# Altium schematic sheet 12V_Buck.SchDoc: Title
size A3; Project: Q24 VCU; ENG_APP_DATE: --/--/--; DSN_APP_DATE: --/--/--; CHK_APP_DATE: --/--/--; Date: *******; ApprovedBy: *******; CheckedBy: None; Author: *******; CompanyName: *******; DrawnBy: Jacob Chisholm; Engineer: *******; Organization: *******; Address1: *******; Address2: *******; Address3: *******; Address4: *******; DocumentNumber: 10; Revision: *******; SheetNumber: 10; SheetTotal: 14; Address_Website: https://jchisholm204.github.io; E-Mail: JacobChisholm1010@gmail.com; CurrentTime: *******; CurrentDate: *******; Time: *******; DocumentFullPathAndName: *******; DocumentName: *******; ModifiedDate: *******; ImagePath: *******; ProjectName: *******; Application_BuildNumber: *******
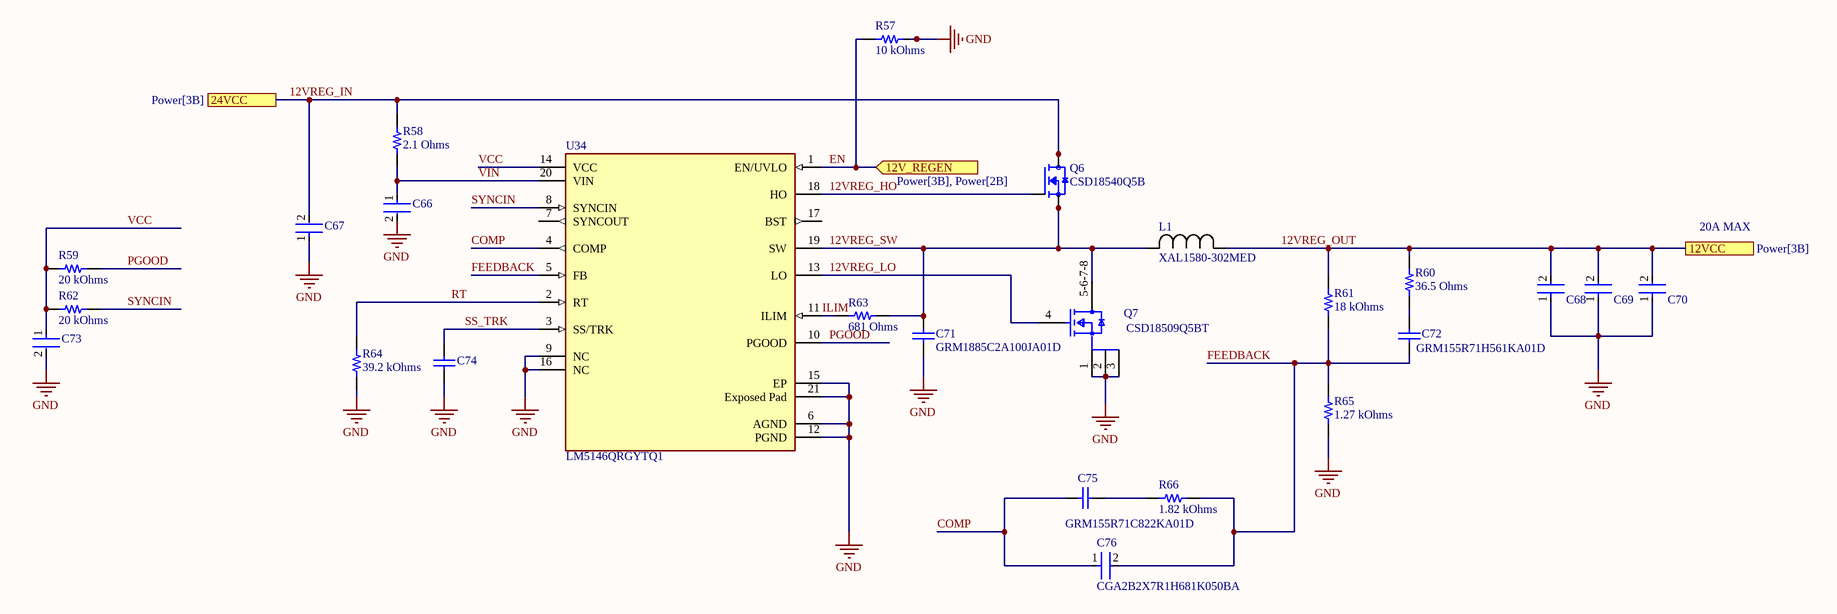
[diagram p0: 12V_Buck.SchDoc]

## Parts
C66  CGA3E2X7R1H104K080AA  [FP-CGA3E-0_3-0_1-IPC_A]  (value not drawn)
C67  GRM32ER71H475KA88L  [FP-GRM32-MFG]  (value not drawn)
C68  GRM32ER61E226KE15L  [FP-GRM32-MFG]  (value not drawn)
C69  GRM32ER61E226KE15L  [FP-GRM32-MFG]  (value not drawn)
C70  GRM32ER61E226KE15L  [FP-GRM32-MFG]  (value not drawn)
C71  GRM1885C2A100JA01D  [CAPC1608X90X35LL10T15]
C72  GRM155R71H561KA01D  [CAPC1005X55X25LL05T10]
C73  C1005X5R1V225K050BC  [FP-C1005-050-0_15-IPC_A]  (value not drawn)
C74  GRM155R71C563KA88D  [CAPC1005X55X25ML05T10]  (value not drawn)
C75  GRM155R71C822KA01D  [CAPC1005X55X25NL05T10]
C76  CGA2B2X7R1H681K050BA  [FP-CGA2B-IPC_C]
L1  XAL1580-302MED  [IND_XAL1580-302MED_COC]
Q6  CSD18540Q5B  [TRANS_CSD18540Q5B]
Q7  CSD18509Q5BT  [FP-DNK0008A-MFG]
R57  10 kOhms  [RES 0603_1608]
R58  2.1 Ohms  [RES 0603_1608]
R59  20 kOhms  [RES 0603_1608]
R60  36.5 Ohms  [RES 0603_1608]
R61  18 kOhms  [RES 0603_1608]
R62  20 kOhms  [RES 0603_1608]
R63  681 Ohms  [RES 0402_1005]
R64  39.2 kOhms  [RES 0603_1608]
R65  1.27 kOhms  [RES 0603_1608]
R66  1.82 kOhms  [RES 0603_1608]
U34  LM5146QRGYTQ1  [FP-RGY0020B-MFG]

## Ports
12V_REGEN (in, see Power[3B], Power[2B]), 12VCC (see Power[3B]), 24VCC (see Power[3B])

## Nets
GND: C66.2 C67.1 C68.1 C69.1 C70.1 C71.1 C73.2 C74.1 Q7.1(S) Q7.2(S) Q7.3(S) R57.2 R64.1 R65.1 U34.6(AGND) U34.9(NC) U34.12(PGND) U34.15(EP) U34.16(NC) U34.21(Exposed_Pad)
12VREG_HO: Q6.4(G) U34.18(HO)
12VREG_IN: C67.2 Q6.5(D) Q6.6(D) Q6.7(D) Q6.8(D) R58.2 ; port 24VCC
12VREG_LO: Q7.4(G) U34.13(LO)
12VREG_OUT: C68.2 C69.2 C70.2 L1.1 R60.2 R61.2 ; port 12VCC
12VREG_SW: C71.2 L1.2 Q6.1(S) Q6.2(S) Q6.3(S) Q7.5-6-7-8(D) R63.2 U34.19(SW)
COMP: C75.1 C76.1 U34.4(COMP)
EN: R57.1 U34.1(EN/UVLO) ; port 12V_REGEN
FEEDBACK: C72.1 C76.2 R61.1 R65.2 R66.2 U34.5(FB)
ILIM: R63.1 U34.11(ILIM)
PGOOD: R59.2 U34.10(PGOOD)
RT: R64.2 U34.2(RT)
SS_TRK: C74.2 U34.3(SS/TRK)
SYNCIN: R62.2 U34.8(SYNCIN)
VCC: C73.1 R59.1 R62.1 U34.14(VCC)
VIN: C66.1 R58.1 U34.20(VIN)
NetC72_2: C72.2 R60.1
NetC75_2: C75.2 R66.1

Not connected (* = marked no-connect by the designer): U34 7(SYNCOUT) 17(BST)

## Notes on the sheet
- 20A MAX
- Title:
- Drawn By:
- Page Contents:
- Checked By:
- Size:
- Date:
- File:
- License:
- Email:
- A3
- Number:
- Time:
- Revision:
- Sheet
- Website:
- of

## Library data of the parts
C66 = CMP-2000-07546-2: Cap Ceramic 100nF 50V X7R 10% Pad SMD 0603 +125°C Automotive T/R; Weight: 7.1E-05oz; Composition: Ceramic; Max Operating Temperature: 125°C; Termination: SMD/SMT; Dielectric: X7R; Length: 1.6mm; Package Quantity: 1; REACH SVHC: No SVHC; Lead Free: Lead Free; Case Code (Metric): 1608; Min Operating Temperature: -55°C; Packaging: Tape and Reel; Tolerance: 10%; Voltage Rating: 50V; Case Code (Imperial): 0603; Capacitance: 100nF; Case/Package: 0603; Voltage Rating (DC): 50V; Depth: 0.8mm; Radiation Hardening: No; Ratings: AEC-Q200; Mount: Surface Mount; Voltage: 50V; Thickness: 0.035inch; Width: 0.8mm; Height: 0.8mm
C67 = CMP-1038-02162-3: CAP CER 4.7UF 50V X7R 1210; Manufacturer: Murata; Tolerance: 10%; Temperature Coefficient: 15%; Material: Ceramic; Lead Free: Yes; Value: 4.7uF; ComponentLink2Description: Datasheet; Capacitance: 4.7uF; Digikey Description: CAP CER 4.7UF 50V X7R 1210; Category: Cap; Automotive: No; ComponentLink2URL: https://search.murata.co.jp/Ceramy/image/img/A01X/G101/ENG/GRM32ER71H475KA88-01A.pdf; Package: GRM32; Device Class L2: Capacitors; Voltage Rating: 50V; Device Class L1: Passive Components; Mouser Description: Capacitor Capacitance tolerance: ±10% Ceramic type: X7R Construction form: 1210 Capacitance: 4.7 µF Rated voltage: 50...; Octopart: https://octopart.com/grm32er71h475ka88l-murata-196576; Temperature: -55°C to +125°C; Temperature Range Low: -55°C; Height: 2.7mm; Manufacturer Part Number: GRM32ER71H475KA88L; Temperature Characteristic: X7R; Temperature Range High: +125°C; RoHS: TRUE; Device Class L3: Ceramic Capacitors
C68-C70 = CMP-2000-05458-2: CAP CER 22UF 25V X5R 1210; Manufacturer: Murata Electronics North America; Possible Substitute: GRM32ER61E226KE15K; Other Names: 490-3889-2; Material: Ceramic; Tolerance: 10%; Digikey Description: CAP CER 22UF 25V X5R 1210; Mouser Description: Multilayer Ceramic Capacitors MLCC - SMD/SMT 1210 22uF 25volts X5R 10%; Device Class L2: Capacitors; Height: 2.7mm; Temperature Characteristic: X5R; Category: Cap; RoHS: TRUE; Operating Temperature: -55°C ~ 85°C; Temperature: -55°C to +85°C; Lead Free: Yes; Package: GRM32; Temperature Range High: +85°C; Package / Case: 1210 (3225 Metric); Standard Package: 1,000; Packaging: Cut Tape (CT); Capacitance: 22uF; Thickness (Max): 0.106" (2.70mm); Value: 22uF; Automotive: No; Device Class L1: Passive Components; Voltage - Rated: 25V; Temperature Range Low: -55°C; Size / Dimension: 0.126" L x 0.098" W (3.20mm x 2.50mm); ComponentLink2Description: Datasheet; Device Class L3: Ceramic Capacitors; Temperature Coefficient: X5R; ComponentLink2URL: https://search.murata.co.jp/Ceramy/image/img/A01X/G101/ENG/GRM32ER61E226KE15-01A.pdf; Voltage Rating: 25V; Manufacturer Part Number: GRM32ER61E226KE15L; Octopart: https://octopart.com/grm32er61e226ke15l-murata-197441; Applications: General Purpose; Mounting Type: Surface Mount, MLCC
C71 = CMP-1035-00565-2: Manufacturer: Murata; Part Number: GRM1885C2A100JA01D
C72 = CMP-2008-04664-1: Manufacturer: Murata; Part Number: GRM155R71H561KA01D
C73 = CMP-08246-007153-1: CAP CER 2.2UF 35V X5R 0402; Dielectric Material: Ceramic; Tolerance: 10%; Package Quantity: 1; Voltage Rating: 35V; Case Code (Metric): 1005; Width: 0.5mm; RoHS Compliant: Yes; Capacitance: 2.2uF; Min Operating Temperature: -55°C; Packaging: Tape and Reel; Voltage Rating (DC): 35V; Thickness: 0.022inch; REACH SVHC: No SVHC; Max Operating Temperature: 85°C; Length: 1mm; Case Code (Imperial): 0402; Resistor Type: Ceramic; Lead Free: Lead Free; Series: C; Termination: SMD/SMT; Height: 0.5mm; Mount: Surface Mount; Case/Package: 0402; Weight: 2.3E-05oz; Dielectric: X5R; Depth: 0.5mm
C74 = CMP-2008-04611-1: Manufacturer: Murata; Part Number: GRM155R71C563KA88D
C75 = CMP-2008-03950-1: Manufacturer: Murata; Part Number: GRM155R71C822KA01D
C76 = CMP-08246-001669-1: Cap Ceramic 680pF 50V X7R 10% Pad SMD 0402 +125°C Automotive T/R; Thickness: 0.022inch; Case Code (Metric): 1005; Voltage Rating: 50V; REACH SVHC: No SVHC; Packaging: Tape and Reel; Min Operating Temperature: -55°C; Case/Package: 0402; Weight: 2.3E-05oz; Tolerance: 10%; Dielectric: X7R; Width: 0.02inch; Case Code (Imperial): 0402; Depth: 0.5mm; Mount: Surface Mount; Length: 1mm; Max Operating Temperature: 125°C; Composition: Ceramic; Termination: SMD/SMT; Voltage Rating (DC): 50V; Height: 0.5mm; Capacitance: 680pF; Ratings: AEC-Q200; Package Quantity: 1
L1 = XAL1580-302MED: No Description Available; Mfr_Name: Coilcraft; Type: DEV; Copyright: Copyright (C) 2024 Ultra Librarian. All rights reserved.; Manufacturer_Part_Number: XAL1580-302MED; RefDes: RefDes
Q6 = CSD18540Q5B: 60-V, N channel NexFETâ„¢ power MOSFET, single SON 5 mm x 6 mm, 2.2 mOhm; MF: Texas Instruments; SnapEDA_Link: https://www.snapeda.com/parts/CSD18540Q5B/Texas+Instruments/view-part/?ref=snap; Purchase-URL: https://pricing.snapeda.com/search/part/CSD18540Q5B/?ref=eda; Package: VSON-CLIP-8 Texas Instruments; MP: CSD18540Q5B; Price: None; Availability: In Stock; Check_prices: https://www.snapeda.com/parts/CSD18540Q5B/Texas+Instruments/view-part/?ref=eda; Value: *
Q7 = CMP-04962-000031-1: MOSFET N-CH 40V 100A 8VSON; Max Power Dissipation: 195W; Drain to Source Resistance: 1.3mR; Gate to Source Voltage (Vgs): 20V; Threshold Voltage: 1.8V; Number of Channels: 1; Rise Time: 19ns; Turn-Off Delay Time: 57ns; Element Configuration: Single; Power Dissipation: 3.1W; Rds On Max: 1.2mR; Fall Time: 11ns; Turn-On Delay Time: 9ns; Input Capacitance: 13.9nF; Packaging: Tape and Reel; Weight: 0.000847oz; Lead Free: Contains Lead; Contact Plating: Gold; Drain to Source Breakdown Voltage: 40V; Max Operating Temperature: 150°C; Number of Elements: 1; Package Quantity: 250; Mount: Surface Mount; Drain to Source Voltage (Vdss): 40V; Number of Pins: 8; Min Operating Temperature: -55°C; REACH SVHC: No SVHC; RoHS Compliant: Yes; Continuous Drain Current (ID): 100A
R57 = AA0603FR-0710KL: RES SMD 10K OHM 1% 1/10W 0603; Manufacturer: Yageo; Power (Watts): 0.1W, 1/10W; Temperature Coefficient: ±150ppm/°C; Part Number: AA0603FR-0710KL; Value: 10 kOhms; ComponentLink1Description: Datasheet; ComponentLink1URL: https://www.yageo.com/upload/media/product/productsearch/datasheet/rchip/PYu-AA_51_RoHS_L_3.pdf; ComponentLink2Description: DigiKey Link; ComponentLink2URL: https://www.digikey.com/en/products/detail/yageo/AA0603FR-0710KL/5888698; Composition: Thick Film; Device Package: 0603 (1608 Metric); Features: Anti-Sulfur, Automotive AEC-Q200, Moisture Resistant; Height - Seated (Max): 0.022" (0.55mm); LastUpdated: 1/24/2024 8:37:51 PM; Lifecycle Status: Active; Minimum Order: 1; Number of Terminations: 2; Operating Temperature: -55°C ~ 155°C; Package / Case: 0603 (1608 Metric); Packaging: TapeAndReel; PartId: 64302; Part Status: Active; Price: 0.01; Ratings: AEC-Q200; Resistance: 10 kOhms; Series: AA; Size / Dimension: 0.063" L x 0.031" W (1.60mm x 0.80mm); Supplier 1: DigiKey; Supplier Part Number 1: 13-AA0603FR-0710KLCT-ND; Supplier Device Package: 0603; Tolerance: ±1%
R58 = CRCW06032R10FKEA: RES SMD 2.1 OHM 1% 1/10W 0603; Manufacturer: Vishay Dale; Power (Watts): 0.1W, 1/10W; Temperature Coefficient: ±100ppm/°C; Part Number: CRCW06032R10FKEA; Value: 2.1 Ohms; ComponentLink1Description: Datasheet; ComponentLink1URL: http://www.vishay.com/docs/20035/dcrcwe3.pdf; ComponentLink2Description: DigiKey Link; ComponentLink2URL: https://www.digikey.com/en/products/detail/vishay-dale/CRCW06032R10FKEA/1961571; Composition: Thick Film; Device Package: 0603 (1608 Metric); Features: Automotive AEC-Q200; Height - Seated (Max): 0.020" (0.50mm); LastUpdated: 1/16/2024 8:42:05 PM; Lifecycle Status: Active; Minimum Order: 1; Number of Terminations: 2; Operating Temperature: -55°C ~ 155°C; Package / Case: 0603 (1608 Metric); Packaging: TapeAndReel; PartId: 12898; Part Status: Active; Price: 0.01; Ratings: AEC-Q200; Resistance: 2.1 Ohms; Series: CRCW; Size / Dimension: 0.061" L x 0.033" W (1.55mm x 0.85mm); Supplier 1: DigiKey; Supplier Part Number 1: 541-2.10HHCT-ND; Supplier Device Package: 0603; Tolerance: ±1%
R59 R62 = AC0603FR-0720KL: RES SMD 20K OHM 1% 1/10W 0603; Manufacturer: Yageo; Power (Watts): 0.1W, 1/10W; Temperature Coefficient: ±100ppm/°C; Part Number: AC0603FR-0720KL; Value: 20 kOhms; ComponentLink1Description: Datasheet; ComponentLink1URL: https://www.yageo.com/upload/media/product/productsearch/datasheet/rchip/PYu-AC_51_RoHS_L_7.pdf; ComponentLink2Description: DigiKey Link; ComponentLink2URL: https://www.digikey.com/en/products/detail/yageo/AC0603FR-0720KL/5895907; Composition: Thick Film; Device Package: 0603 (1608 Metric); Features: Automotive AEC-Q200, Moisture Resistant; Height - Seated (Max): 0.022" (0.55mm); LastUpdated: 1/16/2024 8:41:47 PM; Lifecycle Status: Active; Minimum Order: 1; Number of Terminations: 2; Operating Temperature: -55°C ~ 155°C; Package / Case: 0603 (1608 Metric); Packaging: CutTape; PartId: 17364; Part Status: Active; Price: 0.01; Ratings: AEC-Q200; Resistance: 20 kOhms; Series: AC; Size / Dimension: 0.063" L x 0.031" W (1.60mm x 0.80mm); Supplier 1: DigiKey; Supplier Part Number 1: YAG3577CT-ND; Supplier Device Package: 0603; Tolerance: ±1%
R60 = CRCW060336R5FKEA: RES SMD 36.5 OHM 1% 1/10W 0603; Manufacturer: Vishay Dale; Power (Watts): 0.1W, 1/10W; Temperature Coefficient: ±100ppm/°C; Part Number: CRCW060336R5FKEA; Value: 36.5 Ohms; ComponentLink1Description: Datasheet; ComponentLink1URL: http://www.vishay.com/docs/20035/dcrcwe3.pdf; ComponentLink2Description: DigiKey Link; ComponentLink2URL: https://www.digikey.com/en/products/detail/vishay-dale/CRCW060336R5FKEA/1174503; Composition: Thick Film; Device Package: 0603 (1608 Metric); Features: Automotive AEC-Q200; Height - Seated (Max): 0.020" (0.50mm); LastUpdated: 1/24/2024 8:39:33 PM; Lifecycle Status: Active; Minimum Order: 1; Number of Terminations: 2; Operating Temperature: -55°C ~ 155°C; Package / Case: 0603 (1608 Metric); Packaging: TapeAndReel; PartId: 7915; Part Status: Active; Price: 0.01; Ratings: AEC-Q200; Resistance: 36.5 Ohms; Series: CRCW; Size / Dimension: 0.061" L x 0.033" W (1.55mm x 0.85mm); Supplier 1: DigiKey; Supplier Part Number 1: 541-36.5HCT-ND; Supplier Device Package: 0603; Tolerance: ±1%
R61 = AC0603FR-0718KL: RES SMD 18K OHM 1% 1/10W 0603; Manufacturer: Yageo; Power (Watts): 0.1W, 1/10W; Temperature Coefficient: ±100ppm/°C; Part Number: AC0603FR-0718KL; Value: 18 kOhms; ComponentLink1Description: Datasheet; ComponentLink1URL: https://www.yageo.com/upload/media/product/productsearch/datasheet/rchip/PYu-AC_51_RoHS_L_7.pdf; ComponentLink2Description: DigiKey Link; ComponentLink2URL: https://www.digikey.com/en/products/detail/yageo/AC0603FR-0718KL/5895836; Composition: Thick Film; Device Package: 0603 (1608 Metric); Features: Automotive AEC-Q200, Moisture Resistant; Height - Seated (Max): 0.022" (0.55mm); LastUpdated: 1/24/2024 8:38:56 PM; Lifecycle Status: Active; Minimum Order: 1; Number of Terminations: 2; Operating Temperature: -55°C ~ 155°C; Package / Case: 0603 (1608 Metric); Packaging: CutTape; PartId: 17436; Part Status: Active; Price: 0.01; Ratings: AEC-Q200; Resistance: 18 kOhms; Series: AC; Size / Dimension: 0.063" L x 0.031" W (1.60mm x 0.80mm); Supplier 1: DigiKey; Supplier Part Number 1: YAG3570CT-ND; Supplier Device Package: 0603; Tolerance: ±1%
R63 = ERJ-2RKF6810X: RES SMD 681 OHM 1% 1/10W 0402; Manufacturer: Panasonic Electronic Components; Power (Watts): 0.1W, 1/10W; Temperature Coefficient: ±100ppm/°C; Part Number: ERJ-2RKF6810X; Value: 681 Ohms; ComponentLink1Description: Datasheet; ComponentLink1URL: https://industrial.panasonic.com/cdbs/www-data/pdf/RDA0000/AOA0000C304.pdf; ComponentLink2Description: DigiKey Link; ComponentLink2URL: https://www.digikey.com/en/products/detail/panasonic-electronic-components/ERJ-2RKF6810X/192449; Composition: Thick Film; Device Package: 0402 (1005 Metric); Features: Automotive AEC-Q200; Height - Seated (Max): 0.016" (0.40mm); LastUpdated: 1/24/2024 8:27:52 PM; Lifecycle Status: Active; Minimum Order: 1; Number of Terminations: 2; Operating Temperature: -55°C ~ 155°C; Package / Case: 0402 (1005 Metric); Packaging: CutTape; PartId: 3811; Part Status: Active; Price: 0.01; Ratings: AEC-Q200; Resistance: 681 Ohms; Series: ERJ-2RK; Size / Dimension: 0.039" L x 0.020" W (1.00mm x 0.50mm); Supplier 1: DigiKey; Supplier Part Number 1: P681LCT-ND; Supplier Device Package: 0402; Tolerance: ±1%
R64 = 5-2176089-3: RES SMD 39.2K OHM 0.1% 1/6W 0603; Manufacturer: TE Connectivity Passive Product; Power (Watts): 0.167W, 1/6W; Temperature Coefficient: ±25ppm/°C; Part Number: 5-2176089-3; Value: 39.2 kOhms; ComponentLink1Description: Datasheet; ComponentLink1URL: https://www.te.com/commerce/DocumentDelivery/DDEController?Action=srchrtrv&DocNm=1773272&DocType=DS&DocLang=English; ComponentLink2Description: DigiKey Link; ComponentLink2URL: https://www.digikey.com/en/products/detail/te-connectivity-passive-product/5-2176089-3/4033729; Composition: Thin Film; Device Package: 0603 (1608 Metric); Height - Seated (Max): 0.022" (0.55mm); LastUpdated: 1/16/2024 8:41:51 PM; Lifecycle Status: Active; Minimum Order: 1; Number of Terminations: 2; Operating Temperature: -55°C ~ 155°C; Package / Case: 0603 (1608 Metric); Packaging: TapeAndReel; PartId: 16250; Part Status: Active; Price: 0.14; Resistance: 39.2 kOhms; Series: RP73P, Holsworthy; Size / Dimension: 0.061" L x 0.031" W (1.55mm x 0.80mm); Supplier 1: DigiKey; Supplier Part Number 1: A110261CT-ND; Supplier Device Package: 0603; Tolerance: ±0.1%
R65 = 2-2176088-2: RES SMD 1.27K OHM 0.1% 1/6W 0603; Manufacturer: TE Connectivity Passive Product; Power (Watts): 0.167W, 1/6W; Temperature Coefficient: ±25ppm/°C; Part Number: 2-2176088-2; Value: 1.27 kOhms; ComponentLink1Description: Datasheet; ComponentLink1URL: https://www.te.com/commerce/DocumentDelivery/DDEController?Action=srchrtrv&DocNm=1773272&DocType=DS&DocLang=English; ComponentLink2Description: DigiKey Link; ComponentLink2URL: https://www.digikey.com/en/products/detail/te-connectivity-passive-product/2-2176088-2/4033586; Composition: Thin Film; Device Package: 0603 (1608 Metric); Height - Seated (Max): 0.022" (0.55mm); LastUpdated: 1/24/2024 8:38:18 PM; Lifecycle Status: Active; Minimum Order: 1; Number of Terminations: 2; Operating Temperature: -55°C ~ 155°C; Package / Case: 0603 (1608 Metric); Packaging: TapeAndReel; PartId: 24589; Part Status: Active; Price: 0.14; Resistance: 1.27 kOhms; Series: RP73P, Holsworthy; Size / Dimension: 0.061" L x 0.031" W (1.55mm x 0.80mm); Supplier 1: DigiKey; Supplier Part Number 1: A110118CT-ND; Supplier Device Package: 0603; Tolerance: ±0.1%
R66 = AC0603FR-071K82L: RES SMD 1.82K OHM 1% 1/10W 0603; Manufacturer: Yageo; Power (Watts): 0.1W, 1/10W; Temperature Coefficient: ±100ppm/°C; Part Number: AC0603FR-071K82L; Value: 1.82 kOhms; ComponentLink1Description: Datasheet; ComponentLink1URL: https://www.yageo.com/upload/media/product/productsearch/datasheet/rchip/PYu-AC_51_RoHS_L_9.pdf; ComponentLink2Description: DigiKey Link; ComponentLink2URL: https://www.digikey.com/en/products/detail/yageo/AC0603FR-071K82L/5895873; Composition: Thick Film; Device Package: 0603 (1608 Metric); Features: Automotive AEC-Q200, Moisture Resistant; Height - Seated (Max): 0.022" (0.55mm); LastUpdated: 1/24/2024 8:37:18 PM; Lifecycle Status: Active; Minimum Order: 1; Number of Terminations: 2; Operating Temperature: -55°C ~ 155°C; Package / Case: 0603 (1608 Metric); Packaging: CutTape; PartId: 72129; Part Status: Active; Price: 0.01; Ratings: AEC-Q200; Resistance: 1.82 kOhms; Series: AC; Size / Dimension: 0.063" L x 0.031" W (1.60mm x 0.80mm); Supplier 1: DigiKey; Supplier Part Number 1: 13-AC0603FR-071K82LCT-ND; Supplier Device Package: 0603; Tolerance: ±1%
U34 = CMP-04918-000302-1: IC REG BUCK ADJ 3.5A 20VQFN; RoHS Compliant: Yes